# EAGLE design pc_healthypi_5.2_carrier_usb (EAGLE 9.6.2)
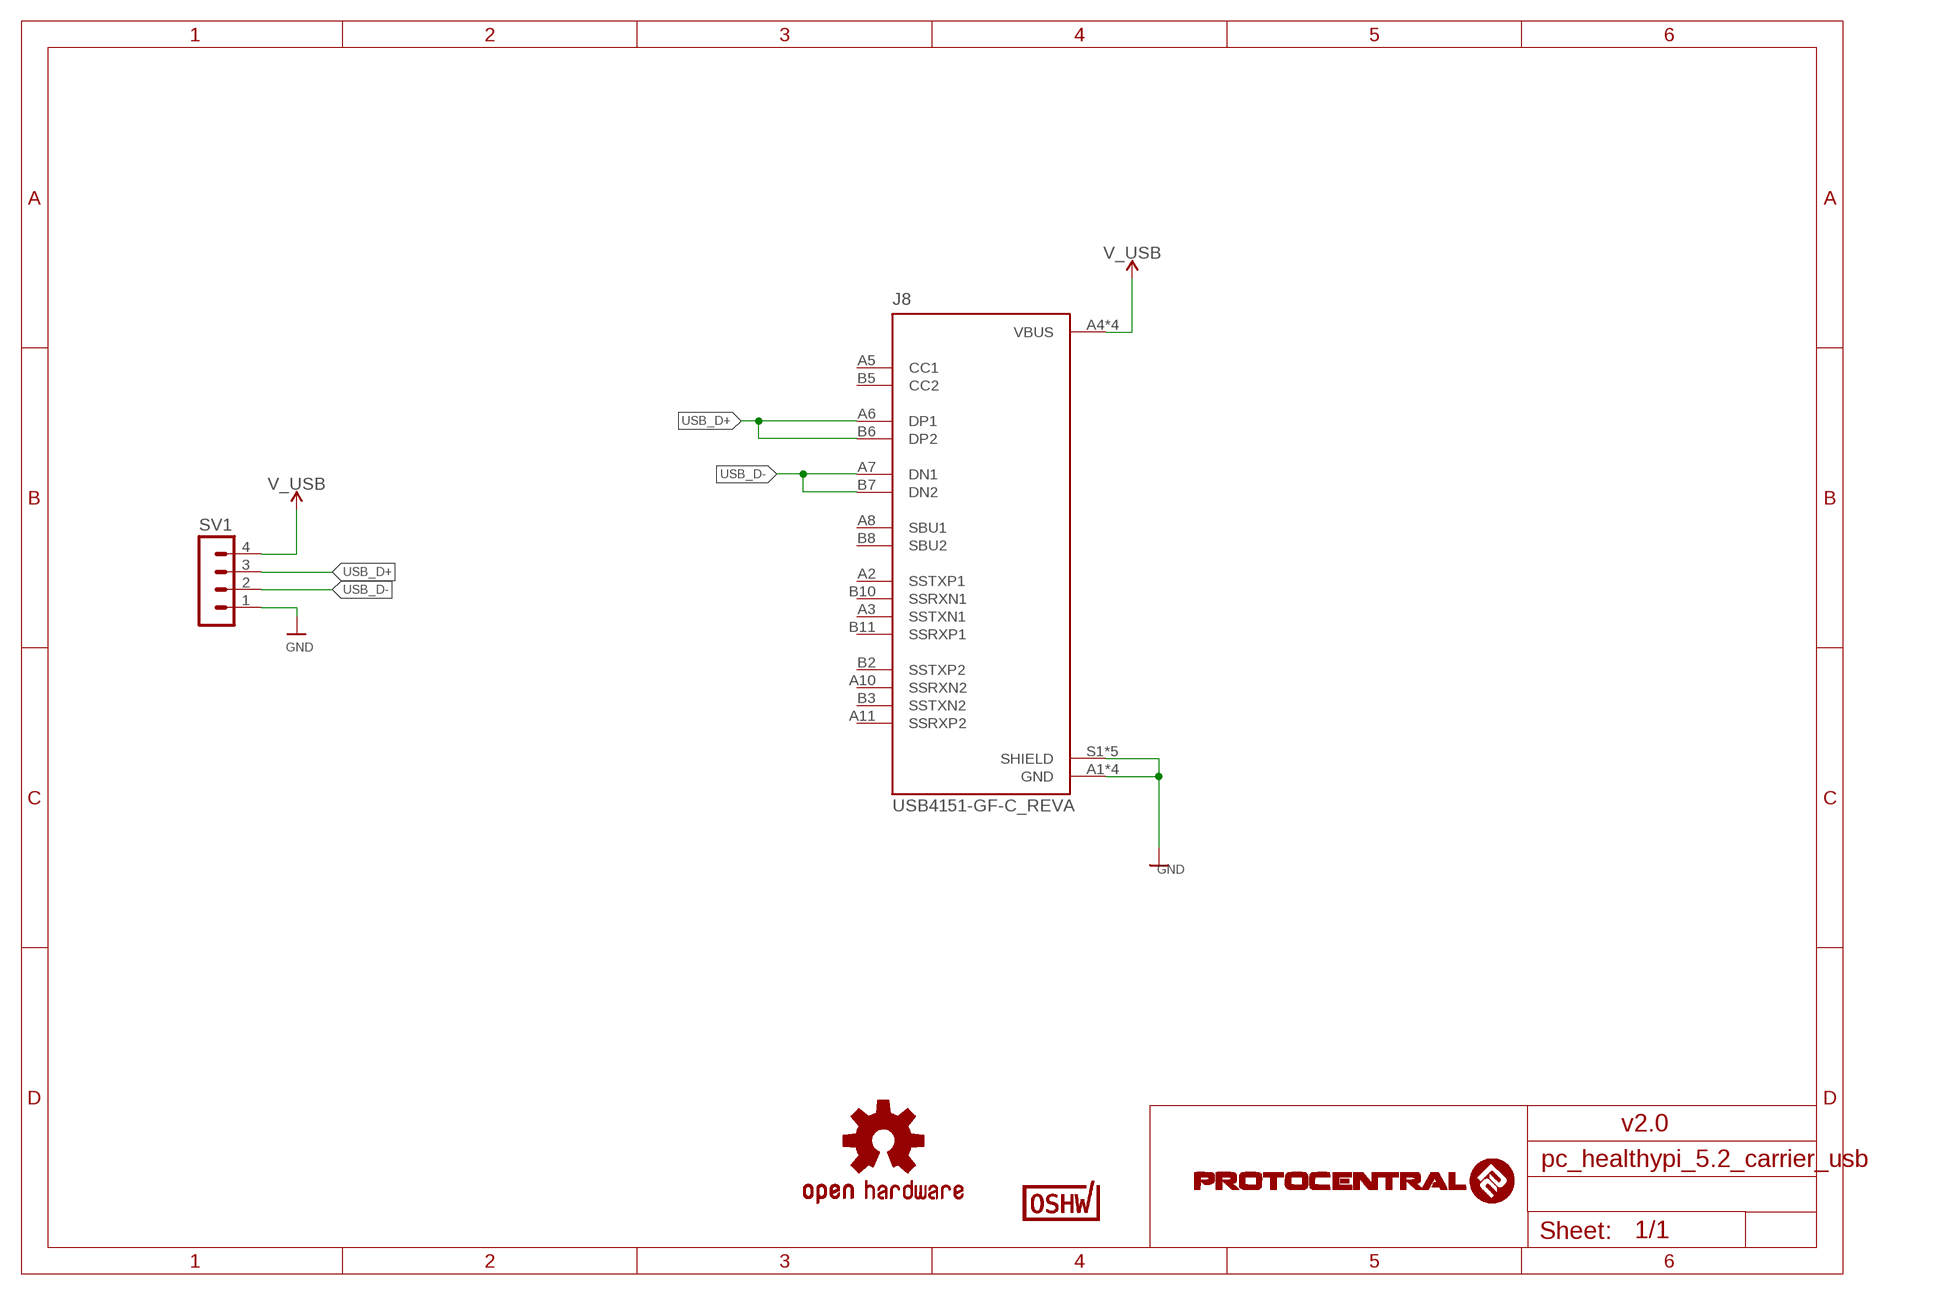
[diagram p0: schematic, sheet 1]

## Parts
J8  USB4151-GF-C_REVA  [GCT_USB4151-GF-C_REVA]
SV1  MA04-1  [MA04-1]
U$13  CERT-SMALL  [CERT-SMALL-SILK]
U$42  OSHW-LOGOM  [OSHW-LOGO-M]

## Nets
GND: J8.A1(GND) J8.A12(GND) J8.B1(GND) J8.B12(GND) J8.S1(SHIELD) J8.S2(SHIELD) J8.S3(SHIELD) J8.S4(SHIELD) J8.S5(SHIELD) SV1.1
USB_D+: J8.A6(DP1) J8.B6(DP2) SV1.3
USB_D-: J8.A7(DN1) J8.B7(DN2) SV1.2
V_USB: J8.A4(VBUS) J8.A9(VBUS) J8.B4(VBUS) J8.B9(VBUS) SV1.4
Unconnected: J8.A2(SSTXP1) J8.A3(SSTXN1) J8.A5(CC1) J8.A8(SBU1) J8.A10(SSRXN2) J8.A11(SSRXP2) J8.B2(SSTXP2) J8.B3(SSTXN2) J8.B5(CC2) J8.B8(SBU2) J8.B10(SSRXN1) J8.B11(SSRXP1)

## Notes on the sheet
- v2.0

## Library data of the parts
J8 = circuitects:USB4151-GF-C_REVA: USB Type C Plug, Vertical, SMT; DESCRIPTION: USB Type C 3.1 vertical surface mount connector, 11.10mm profile, 24 Pins, Through hole; DIGI-KEY_PART_NUMBER: 2073-USB4151-GF-CTR-ND; MF: Global Connector Technology; MP: USB4151-GF-C; PACKAGE: None; PURCHASE-URL: https://pricing.snapeda.com/search/part/USB4151-GF-C/?ref=eda
SV1 = con-lstb:MA04-1: PIN HEADER; OC_FARNELL: unknown; OC_NEWARK: unknown
U$13 = OSHWA:CERT
U$42 = SparkFun:OSHW-LOGO: Open Source Hardware Logo This logo indicates the piece of hardware it is found on incorporates a OSHW license and/or adheres to the definition of open source hardware found here: http://freedomdefined.org/OSHW

## Board
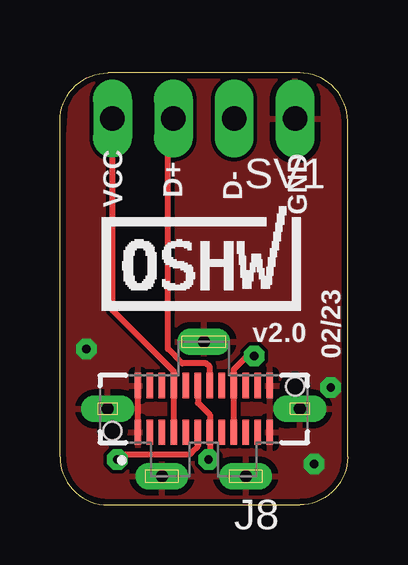
[diagram p1: board, top side]
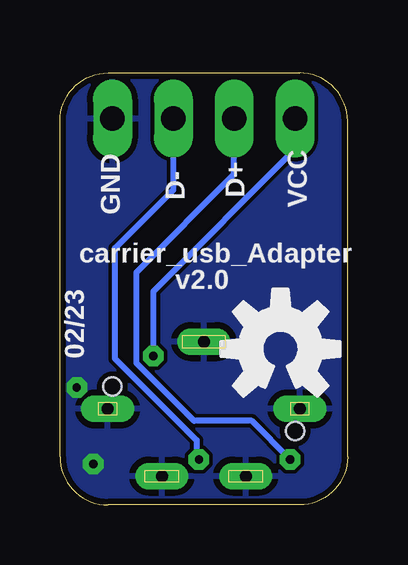
[diagram p2: board, bottom side, seen from below]

Size 12 x 18 mm. Coordinates in mm from the lower left corner, seen from the top.
Outline: 2,0 10,0 arc90 12,2 12,16 arc90 10,18 2,18 arc90 0,16 0,2 arc90 2,0
Copper layers (1*2*15*16): Top 0.035mm / dielectric 1.5mm / Route2 0.035mm / dielectric 0.15mm / Route15 0.035mm / dielectric 0.2mm / Bottom 0.035mm
Design rules "Circuitects-Rules": minimum track width 6mil, minimum drill 0.3mm, track to track 6mil, track to pad 6mil, pad to pad 6mil, via to via 6mil, smd to smd 6mil, copper to edge 10mil, drill to drill 8mil, minimum pad ring 12mil, minimum via ring 10mil, stop-mask expansion 4mil, vias tented up to drill 25mil, thermal gap 10mil

### Footprints (pad centres in the part's own frame; a part is rotated, then mirrored left to right if it is on the bottom)
GCT_USB4151-GF-C_REVA = smd 0.28 x 1.05: A1 2.75,0.975; A2 2.25,0.975; A3 1.75,0.975; A4 1.25,0.975; A5 0.75,0.975; A6 0.25,0.975; A7 -0.25,0.975; A8 -0.75,0.975; A9 -1.25,0.975; A10 -1.75,0.975; A11 -2.25,0.975; A12 -2.75,0.975; B1 -2.75,-0.975; B2 -2.25,-0.975; B3 -1.75,-0.975; B4 -1.25,-0.975; B5 -0.75,-0.975; B6 -0.25,-0.975; B7 0.25,-0.975; B8 0.75,-0.975; B9 1.25,-0.975; B10 1.75,-0.975; B11 2.25,-0.975; B12 2.75,-0.975 | drill 0.5 pad 0.85 long: S1 -4.01,0; S4 4.01,0 | drill 0.5 pad 1 long: S2 -1.75,2.8; S3 1.75,2.8 | drill 0.5 pad 1.1 long: S5 0,-2.8 | hole 0.75: 3.81,0.92; -3.81,-0.93
MA04-1 = drill 1.016 long: 1 -3.81,0; 2 -1.27,0; 3 1.27,0; 4 3.81,0

### Placement (x,y rotation side)
J8  6,4 180 top
SV1  6,16.1 180 top
U$13  5.9,8.1 0 top
U$42  2.8,6.5 0 bottom

### Tracks (layer width: path | path; a pad name or v marks a point on that pad's centre or on a via)
GND  (via drill 0.35)
  Top 0.254: J8.A1 J8.B12
  other vias: 1.1,6.5 10.6,1.7 11.3,4.9
  pour Top: 0,0 12,0 12,10.4 12,18 0.5,18 0,11
  pour Bottom: 0,0 12,0 12,18 0,18 0,0.1
USB_D+  (via drill 0.35)
  Top 0.254: J8.B6 6.25,5.75 6.1,5.9 5.1,5.9 4.5,6.5 4.5,15.87 SV1.3 | J8.A6 5.75,2.45 5.49,2.19 5.4,2.1 2.6,2.1 v2.4,1.9
  Bottom 0.254: v2.4,1.9 4,3.5 6.4,3.5 8.81,5.91 8.81,9.69 4.73,13.77 SV1.3
USB_D-  (via drill 0.35)
  Top 0.254: J8.B7 5.75,4.25 6.25,3.75 J8.A7 6.25,1.95 v6.2,1.9
  Bottom 0.254: v6.2,1.9 6.3,2 6.3,2.7 9.7,6.1 9.7,10.7 7.27,13.13 SV1.2
V_USB  (via drill 0.35)
  Top 0.254: J8.A4 J8.B9 4.75,5.55 2.19,8.11 SV1.4 | v8.1,6.2 7.8,6.2 7.25,5.65 J8.B4 J8.A9
  Bottom 0.254: v8.1,6.2 8.1,8.9 2.19,14.81 SV1.4

### Text on the board
tPlace: D+ | D- | VCC | GND | v2.0 | 02/23
bPlace: D+ | D- | VCC | GND | carrier_usb_Adapter | v2.0 | 02/23